# EasyEDA schematic schematic.json
TITLE: TwoButtons; REV: 1.1; Date: 2019-03-30; Sheet: 1/1; Drawn By: Sobotkama; Company: DDM Praha 9
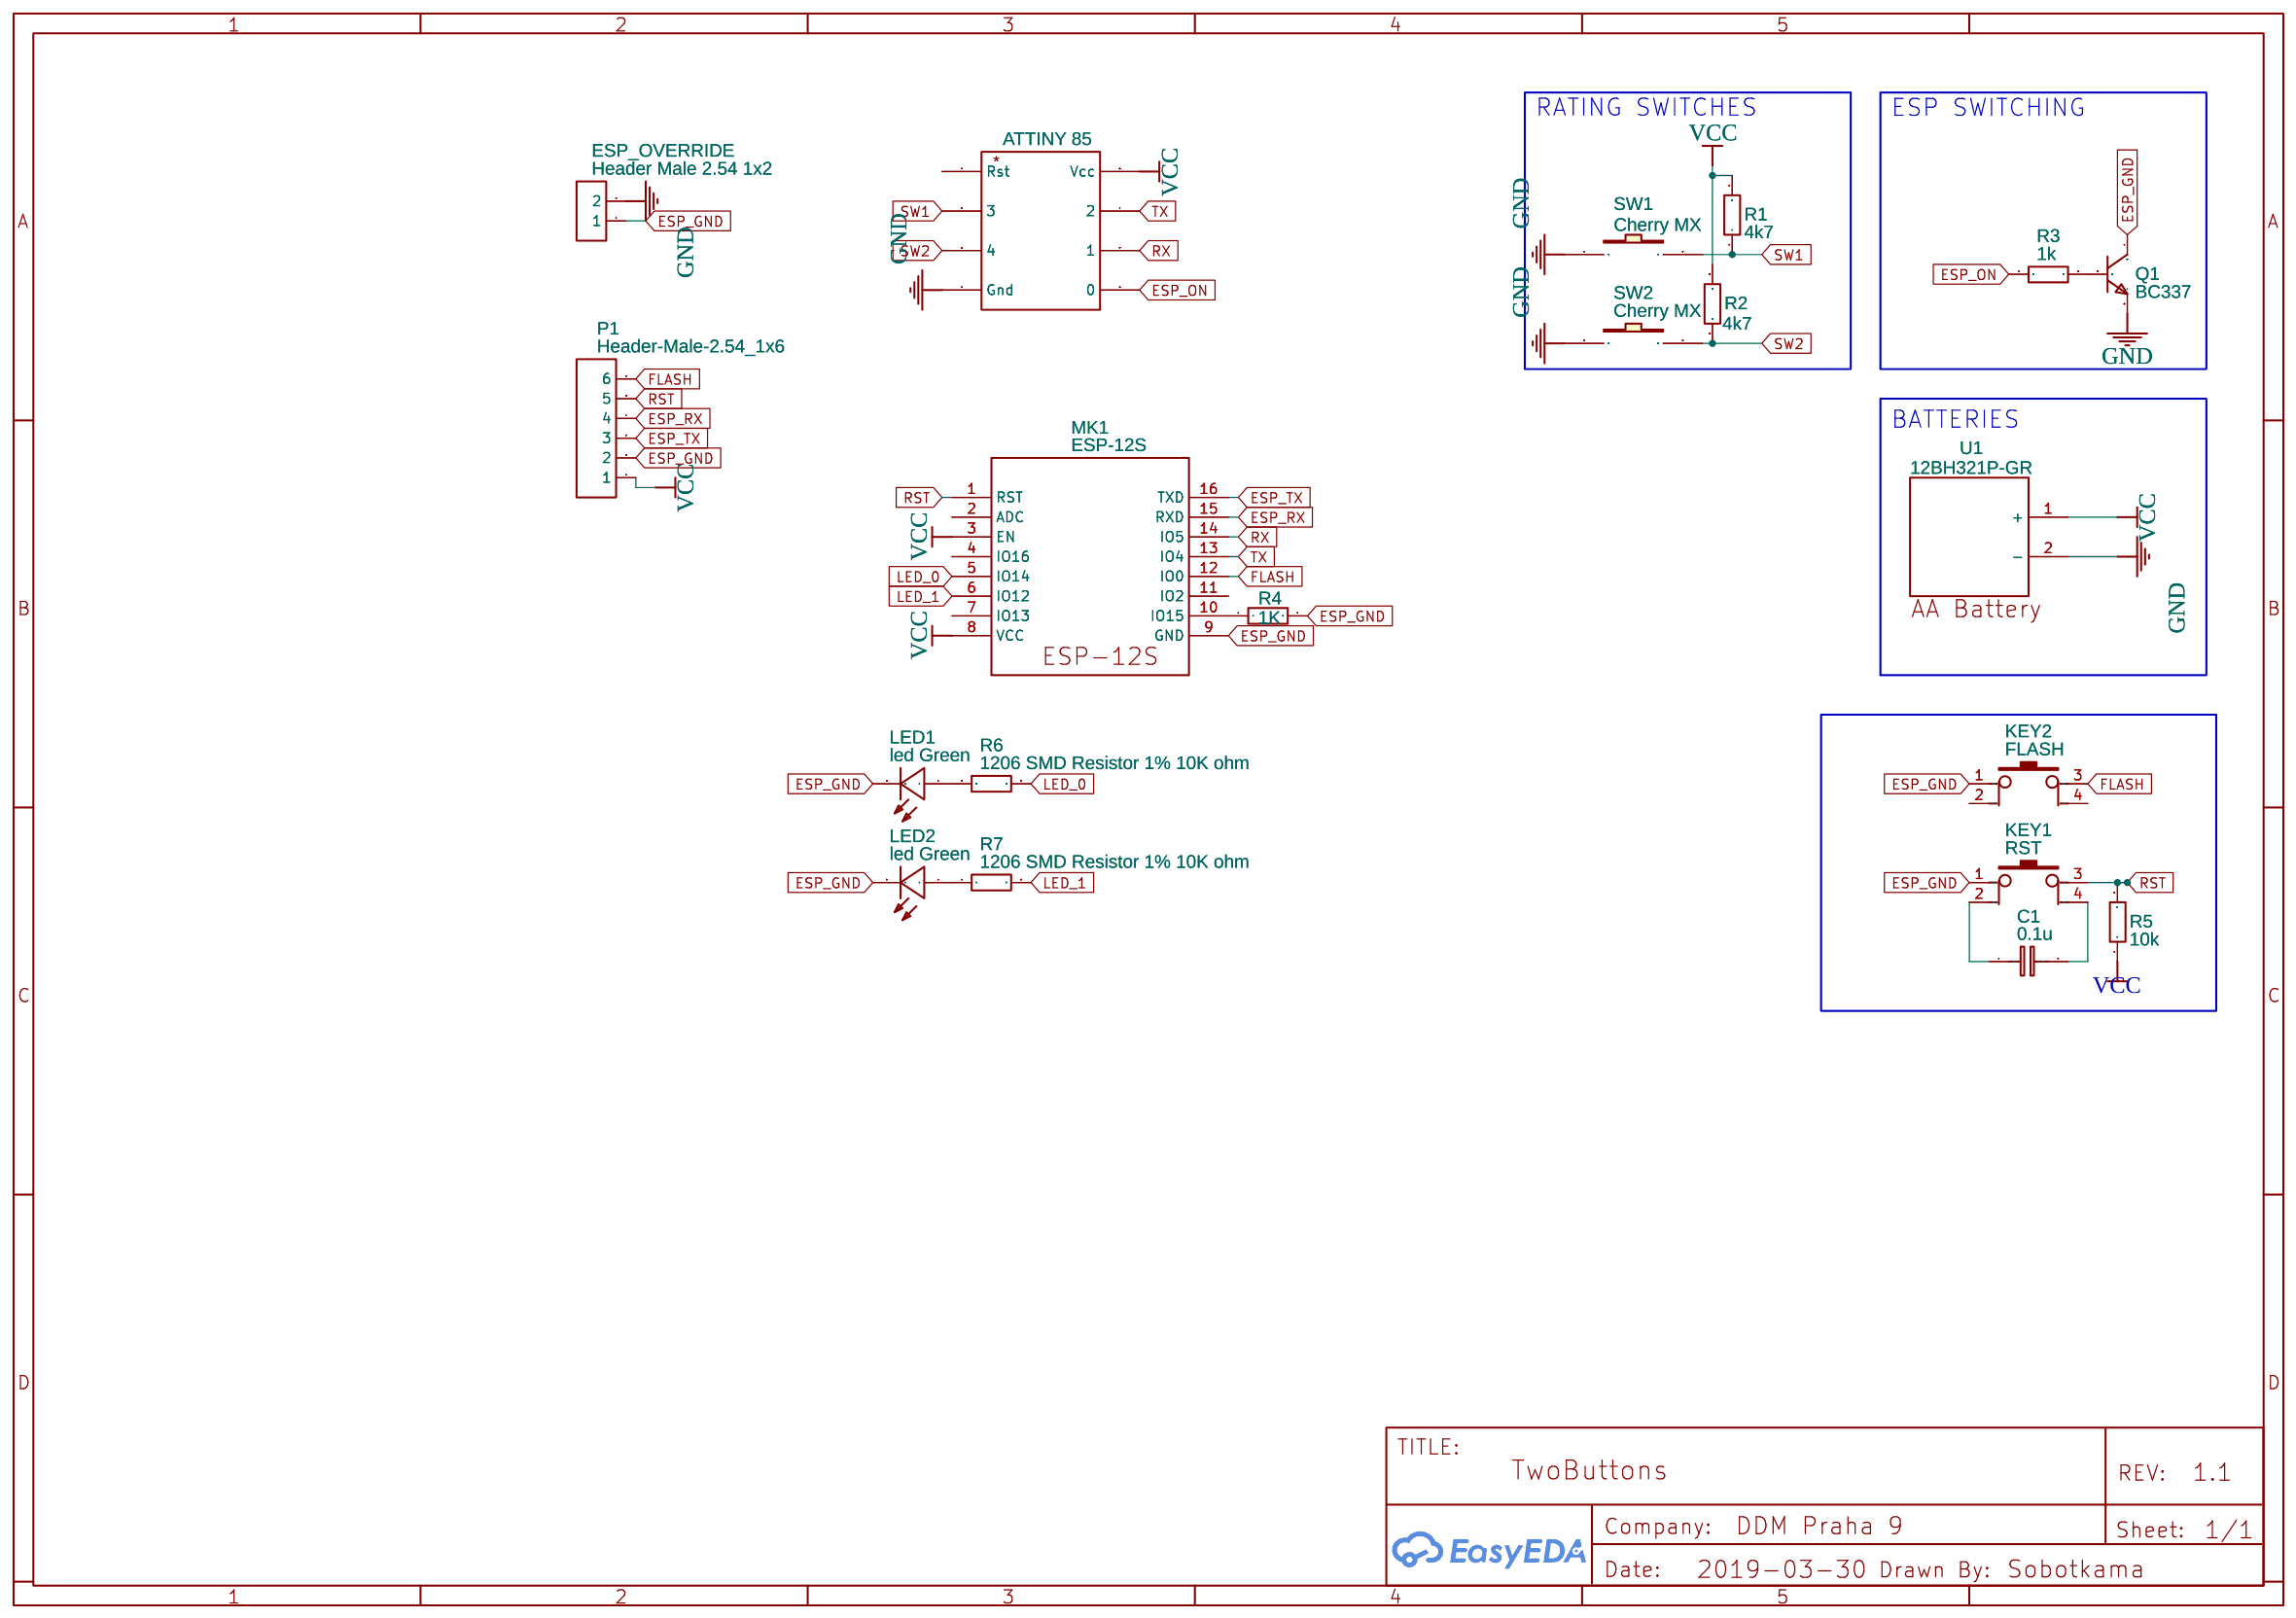
[diagram p0: schematic sheet]

## Parts
ATTINY1  ATTINY 85  [TINY85]
C1  0.1u  [RAD-0.1]
ESP_OVERRIDE  Header Male 2.54 1x2  [HDR-2X1/2.54]
KEY1  RST  [KEY-6.0*6.0-2]
KEY2  FLASH  [KEY-6.0*6.0-2]
LED1  led Green  [LED-1206]
LED2  led Green  [LED-1206]
MK1  ESP-12S  [ESP-12S]
P1  Header-Male-2.54_1x6  [HDR-6X1/2.54]
Q1  BC337  [TO-92(TO-92-3)]
R1  4k7  [AXIAL-0.4]
R2  4k7  [AXIAL-0.4]
R3  1k  [AXIAL-0.4]
R4  1K  [AXIAL-0.4]
R5  10k  [AXIAL-0.4]
R6  1206 SMD Resistor 1% 10K ohm  [1206]
R7  1206 SMD Resistor 1% 10K ohm  [1206]
SW1  Cherry MX  [CHERRY MX 1U]
SW2  Cherry MX  [CHERRY MX 1U]
U1  12BH321P-GR  [12BH321P-GR]

## Library data of the parts
ATTINY1 = -: Contributor: frederic.vigreux; sourceId: jhb5mEye8; Manufacturer Part: ?
C1 = Cap_RAD-0.1_EU: Manufacturer Part: ?
ESP_OVERRIDE = -: Supplier: Digi-Key; Manufacturer: TE Connectivity; Manufacturer Part: 826629-2; image: //image.lceda.cn/szlcsc/C86471.jpg; Supplier Part: A105107-ND; Contributor: dare951
KEY1 KEY2 = -: Supplier Part: C59982; Supplier: LCSC; Manufacturer: ReliaPro; Manufacturer Part: button6*6*8; image: http://image.lceda.cn/szlcsc/C59982.jpg
LED1 LED2 = -: Supplier: LCSC; Manufacturer: KENTO; image: //image.lceda.cn/szlcsc/C14641.jpg; Supplier Part: C14641
MK1 = -: Supplier: LCSC; Manufacturer: Ai-Thinker; Contributor: LCSC; Supplier Part: C82898
P1 = -: Supplier: LCSC; Manufacturer: BOOMELE; Supplier Part: C37208
Q1 = -: Supplier Part: C154963; Supplier: LCSC; Manufacturer: CJ; Contributor: LCSC
R1-R3 R5 = 330 Resistor THT (C58608): Supplier: LCSC; Manufacturer: UniOhm; Manufacturer Part: MFR0W4F3300A50; Supplier Part: C58608
R4 = 1K Ohm Resistor THT (C120055): Supplier: LCSC; Supplier Part: C120055; Manufacturer: Chian Chia Elec; Contributor: LCSC
R6 R7 = -: Power: 1/4W; Tolerance: ±1%
SW1 SW2 = -: Manufacturer Part: ?
U1 = -: link: http://www.mouser.com/ds/2/209/EPD-200434-191945.pdf; Contributor: chumley133

## Nets
GND: ATTINY1.4(Gnd) ESP_OVERRIDE.2 Q1.3(E) SW1.1 SW2.1 U1.2(-)
VCC: ATTINY1.8(Vcc) MK1.3(EN) MK1.8(VCC) P1.1 R1.2 R2.2 R5.1 U1.1(+)
ESP_GND: ESP_OVERRIDE.1 KEY1.1 KEY2.1 LED1.2(K) LED2.2(K) MK1.9(GND) P1.2 Q1.1(C) R4.2
ESP_ON: ATTINY1.5(0) R3.1
ESP_RX: MK1.15(RXD) P1.4
ESP_TX: MK1.16(TXD) P1.3
FLASH: KEY2.3 MK1.12(IO0) P1.6
LED_0: MK1.5(IO14) R6.2
LED_1: MK1.6(IO12) R7.2
RST: KEY1.3 MK1.1(RST) P1.5 R5.2
RX: ATTINY1.6(1) MK1.14(IO5)
SW1: ATTINY1.2(3) R1.1 SW1.2
SW2: ATTINY1.3(4) R2.1 SW2.2
TX: ATTINY1.7(2) MK1.13(IO4)
Net-(C1-1): C1.1 KEY1.2
Net-(C1-2): C1.2 KEY1.4
Net-(LED1-1): LED1.1(A) R6.1
Net-(LED2-1): LED2.1(A) R7.1
Net-(MK1-10): MK1.10(IO15) R4.1
Net-(Q1-2): Q1.2(B) R3.2

Not connected (* = marked no-connect by the designer): ATTINY1 1(Rst); KEY2 2 4; MK1 2(ADC) 4(IO16) 7(IO13) 11(IO2)

## Notes on the sheet
- RATING SWITCHES
- ESP SWITCHING
- BATTERIES
